# Altium project HeaderBoardProject.PrjPCB
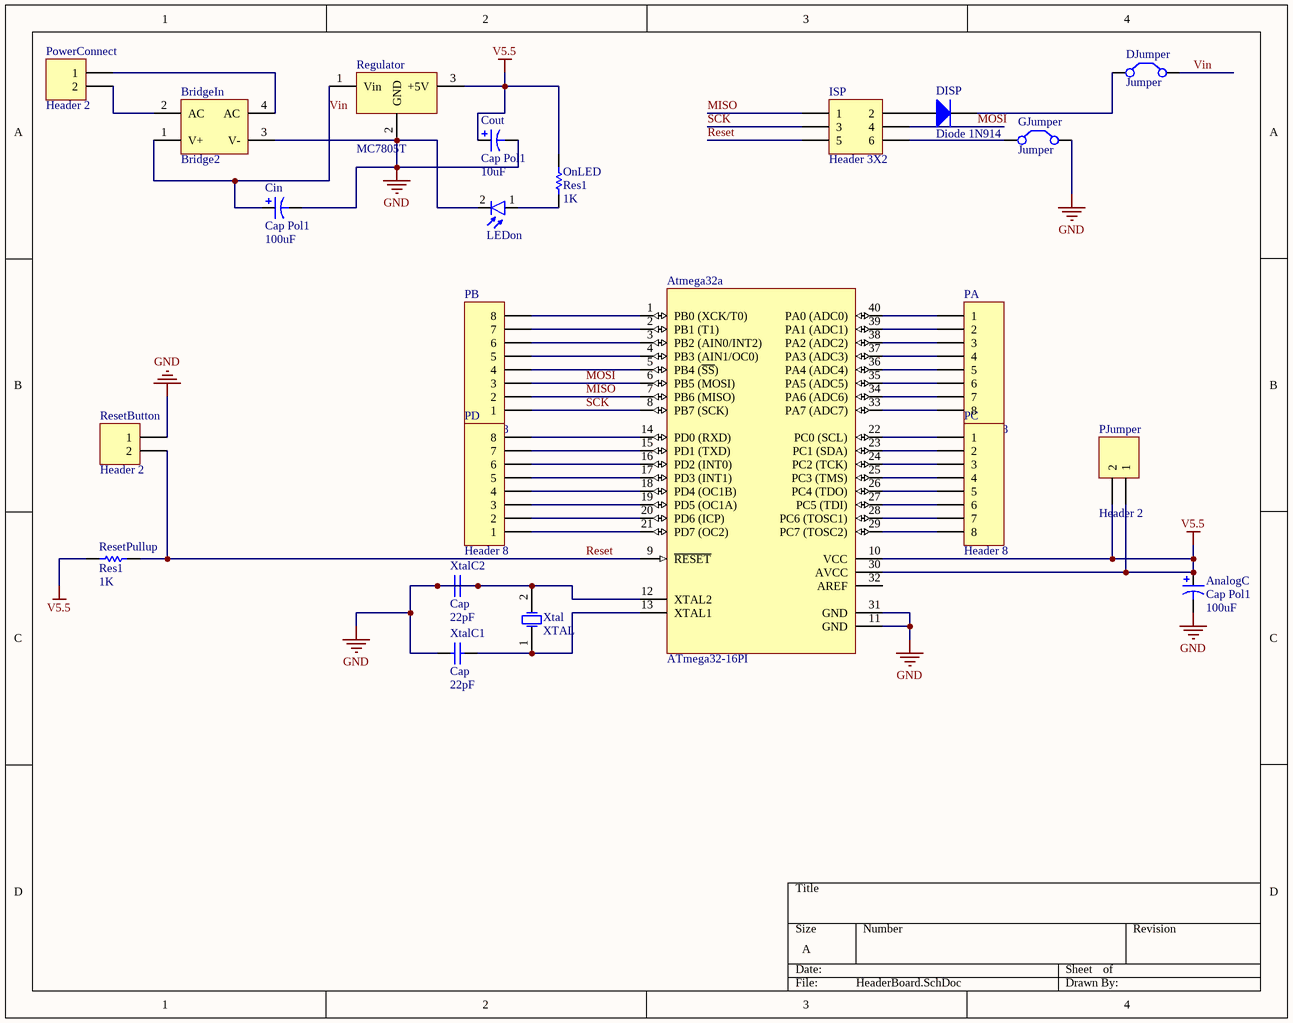
[diagram p0: HeaderBoard.SchDoc]
2 sheets, 23 parts. Net scope: global (net labels, ports and power ports of the same name join across sheets).
Board file: HeaderBoardPCB.PcbDoc
Sheets:
  HeaderBoard.SchDoc
  Components.SchDoc

## Sheet HeaderBoard.SchDoc
size A

### Parts
AnalogC  Cap Pol1  value 100uF  [cap 02]
Atmega32a  ATmega32-16PI  [40P6]
BridgeIn  Bridge2  [Bridge]
Cin  Cap Pol1  value 100uF  [cap 02]
Cout  Cap Pol1  value 10uF  [cap 02]
DISP  Diode 1N914  [DO-35]
DJumper  Jumper  [RAD-0.2]
GJumper  Jumper  [RAD-0.2]
ISP  Header 3X2  [HDR2X3]
LEDon  IR Reciever  [LED-5mm-IR Reciver]  (value not drawn)
OnLED  Res1  value 1K  [AXIAL-0.3]
PA  Header 8  [HDR1X8]
PB  Header 8  [HDR1X8]
PC  Header 8  [HDR1X8]
PD  Header 8  [HDR1X8]
PJumper  Header 2  [HDR1X2]
PowerConnect  Header 2  [HDR1X2]
Regulator  MC7805T  [78XXCV - Right]
ResetButton  Header 2  [HDR1X2]
ResetPullup  Res1  value 1K  [AXIAL-0.3]
Xtal  XTAL  [Crystal SMD]
XtalC1  Cap  value 22pF  [Cap - 100nF]
XtalC2  Cap  value 22pF  [Cap - 100nF]

### Nets
GND: AnalogC.2 Atmega32a.11(GND) Atmega32a.12(XTAL2) Atmega32a.31(GND) BridgeIn.3(V-) Cin.2 Cout.2 GJumper.2(C2) LEDon.2(K) Regulator.2(GND) ResetButton.1 Xtal.2(OSC2) XtalC1.1 XtalC2.1 XtalC2.2
V5.5: AnalogC.1 Atmega32a.10(VCC) Atmega32a.30(AVCC) Cout.1 OnLED.2 PJumper.1 PJumper.2 Regulator.3(+5V) ResetPullup.1
MISO: Atmega32a.7(PB6_(MISO)) ISP.1 PB.2
MOSI: Atmega32a.6(PB5_(MOSI)) ISP.4 PB.3
Reset: Atmega32a.9(~{RESET}) ISP.5 ResetButton.2 ResetPullup.2
SCK: Atmega32a.8(PB7_(SCK)) ISP.3 PB.1
Vin: BridgeIn.1(V+) Cin.1 DJumper.2(C2) Regulator.1(Vin)
NetAtmega32a_1: Atmega32a.1(PB0_(XCK/T0)) PB.8
NetAtmega32a_2: Atmega32a.2(PB1_(T1)) PB.7
NetAtmega32a_3: Atmega32a.3(PB2_(AIN0/INT2)) PB.6
NetAtmega32a_4: Atmega32a.4(PB3_(AIN1/OC0)) PB.5
NetAtmega32a_5: Atmega32a.5(PB4_(~{SS})) PB.4
NetAtmega32a_13: Atmega32a.13(XTAL1) Xtal.1(OSC1) XtalC1.2
NetAtmega32a_14: Atmega32a.14(PD0_(RXD)) PD.8
NetAtmega32a_15: Atmega32a.15(PD1_(TXD)) PD.7
NetAtmega32a_16: Atmega32a.16(PD2_(INT0)) PD.6
NetAtmega32a_17: Atmega32a.17(PD3_(INT1)) PD.5
NetAtmega32a_18: Atmega32a.18(PD4_(OC1B)) PD.4
NetAtmega32a_19: Atmega32a.19(PD5_(OC1A)) PD.3
NetAtmega32a_20: Atmega32a.20(PD6_(ICP)) PD.2
NetAtmega32a_21: Atmega32a.21(PD7_(OC2)) PD.1
NetAtmega32a_22: Atmega32a.22(PC0_(SCL)) PC.1
NetAtmega32a_23: Atmega32a.23(PC1_(SDA)) PC.2
NetAtmega32a_24: Atmega32a.24(PC2_(TCK)) PC.3
NetAtmega32a_25: Atmega32a.25(PC3_(TMS)) PC.4
NetAtmega32a_26: Atmega32a.26(PC4_(TDO)) PC.5
NetAtmega32a_27: Atmega32a.27(PC5_(TDI)) PC.6
NetAtmega32a_28: Atmega32a.28(PC6_(TOSC1)) PC.7
NetAtmega32a_29: Atmega32a.29(PC7_(TOSC2)) PC.8
NetAtmega32a_33: Atmega32a.33(PA7_(ADC7)) PA.8
NetAtmega32a_34: Atmega32a.34(PA6_(ADC6)) PA.7
NetAtmega32a_35: Atmega32a.35(PA5_(ADC5)) PA.6
NetAtmega32a_36: Atmega32a.36(PA4_(ADC4)) PA.5
NetAtmega32a_37: Atmega32a.37(PA3_(ADC3)) PA.4
NetAtmega32a_38: Atmega32a.38(PA2_(ADC2)) PA.3
NetAtmega32a_39: Atmega32a.39(PA1_(ADC1)) PA.2
NetAtmega32a_40: Atmega32a.40(PA0_(ADC0)) PA.1
NetBridgeIn_2: BridgeIn.2(AC) PowerConnect.2
NetBridgeIn_4: BridgeIn.4(AC) PowerConnect.1
NetDISP_1: DISP.1(A) ISP.2
NetDISP_2: DISP.2(K) DJumper.1(C1)
NetGJumper_1: GJumper.1(C1) ISP.6
NetLEDon_1: LEDon.1(A) OnLED.1

Not connected (* = marked no-connect by the designer): Atmega32a 32(AREF)

### Library data of the parts
AnalogC Cin Cout = Cap Pol1: Polarized Capacitor (Radial); Published: 8-Jun-2000; LatestRevisionDate: 17-Jul-2002; LatestRevisionNote: Re-released for DXP Platform.; PackageReference: RB7.6-15; Publisher: Altium Limited; PackageDescription: Polarized Capacitor (Radial); 2 Leads
Atmega32a = ATmega32-16PI: 8-Bit AVR Microcontroller with 32K Bytes of In-System Programmable Flash Memory; Published: 17-Sep-2003; LatestRevisionDate: 4-Mar-2005; LatestRevisionNote: Stylized 3D Model Added.; DatasheetDocument: 2503C-AVR-10/02; PackageDocument: Dec-1999; PackageReference: 40P6; Publisher: Altium Limited; ComponentLink1Description: Manufacturer Link; ComponentLink1URL: http://www.atmel.com; ComponentLink2Description: Datasheet; ComponentLink2URL: http://www.atmel.com/dyn/resources/prod_documents/doc2503.pdf
BridgeIn = Bridge2: Diode Bridge; Published: 24-Mar-1999; LatestRevisionDate: 17-Jul-2002; LatestRevisionNote: Re-released for DXP Platform.; PackageReference: D-46_6A; Publisher: Altium Limited
DISP = Diode 1N914: High Conductance Fast Diode; Published: 8-Jun-2000; LatestRevisionDate: 17-Jul-2002; LatestRevisionNote: Re-released for DXP Platform.; DatasheetVersion: 1997; PackageReference: DO-35; Publisher: Altium Limited; PackageDescription: Diode, Axial; Body 3.8 x 1.9 mm (LxDia. max), Lead Dia. 0.53 mm (max); Code_JEDEC: DO-204-AH; ComponentLink1Description: Manufacturer Link; ComponentLink1URL: http://www.fairchildsemi.com/; ComponentLink2Description: Datasheet; ComponentLink2URL: http://www.fairchildsemi.com/ds/1N%2F1N4448.pdf
DJumper GJumper = Jumper: Jumper Wire; Published: 24-Mar-1999; LatestRevisionDate: 17-Jul-2002; LatestRevisionNote: Re-released for DXP Platform.; PackageReference: RAD-0.2; Publisher: Altium Limited; PackageDescription: Radial Cap, Thru-Hole; 2 Leads; 0.2 in Pin Spacing
ISP = Header 3X2: Header, 3-Pin, Dual row; LatestRevisionDate: 17-Jul-2002; LatestRevisionNote: Re-released for DXP Platform.; Publisher: Altium Limited
LEDon = LED IR Reciever: Infra Red Reciever Photo Diode; Designer: Saeid Jorablo; Organazation: ControTec; Adding Date: 1387/12/22
OnLED ResetPullup = Res1: Resistor; Published: 8-Jun-2000; LatestRevisionDate: 17-Jul-2002; LatestRevisionNote: Re-released for DXP Platform.; PackageReference: AXIAL-0.3; Publisher: Altium Limited; PackageDescription: Axial Device, Thru-Hole; 2 Leads; 0.3 in Pin Spacing
PA PB PC PD = Header 8: Header, 8-Pin; LatestRevisionDate: 17-Jul-2002; LatestRevisionNote: Re-released for DXP Platform.; Publisher: Altium Limited
PJumper PowerConnect ResetButton = Header 2: Header, 2-Pin; LatestRevisionDate: 17-Jul-2002; LatestRevisionNote: Re-released for DXP Platform.; Publisher: Altium Limited
Xtal = XTAL: Crystal Oscillator; Published: 8-Jun-2000; LatestRevisionDate: 17-Jul-2002; LatestRevisionNote: Re-released for DXP Platform.; PackageReference: R38; Publisher: Altium Limited; PackageDescription: Crystal, Thru-Hole; 2 Leads; Body 3.1 x 8.2 mm (Dia.xH)
XtalC1 XtalC2 = Cap: Capacitor; Published: 8-Jun-2000; LatestRevisionDate: 17-Jul-2002; LatestRevisionNote: Re-released for DXP Platform.; PackageReference: RAD-0.3; Publisher: Altium Limited; PackageDescription: Radial Cap, Thru-Hole; 2 Leads; 0.3 in Pin Spacing

## Sheet Components.SchDoc
size A